# Altium schematic sheet SCH.SchDoc
size A; SheetNumber: 1; SheetTotal: 1
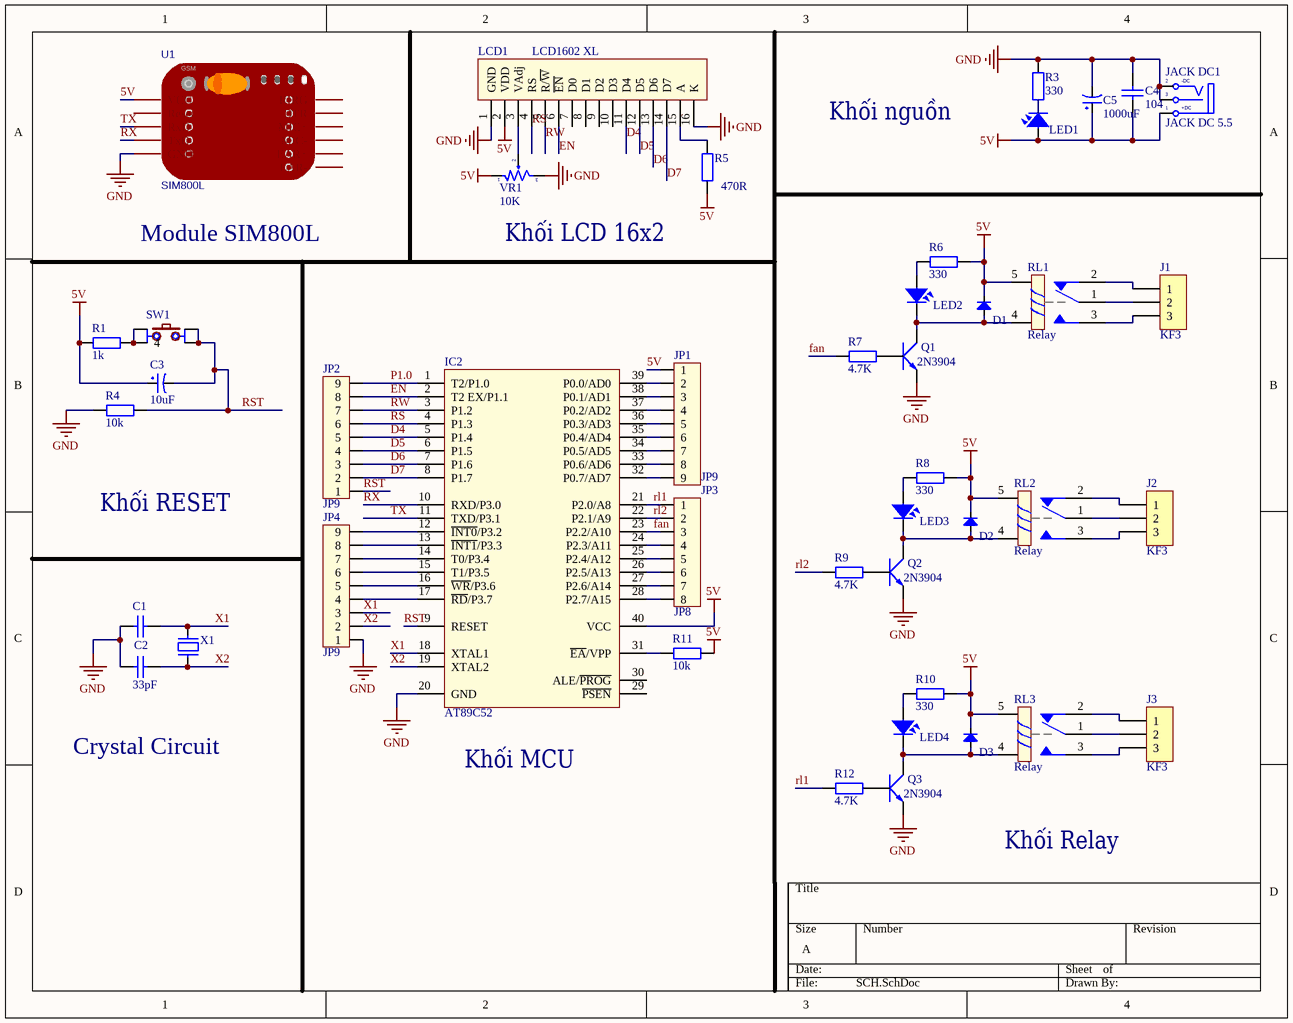
[diagram p0: SCH.SchDoc]

## Parts
C1  30pF  [tu gom]  (value not drawn)
C2  33pF  [tu gom]
C3  10uF  [tu hoa 4mm]
C4  104  [tu gom]
C5  1000uF  [tu hoa 10mm]
D1  Diode  [DIO-1A]  (value not drawn)
D2  Diode  [DIO-1A]  (value not drawn)
D3  Diode  [DIO-1A]  (value not drawn)
IC2  AT89C52  [DIP40/W0.6]
J1  KF3  [KF3-5.08]
J2  KF3  [KF3-5.08]
J3  KF3  [KF3-5.08]
JACK_DC1  JACK DC 5.5  [JACK DC 5.5]
JP1  JP9  [Header9]
JP2  JP9  [Header9]
JP3  JP8  [Header8]
JP4  JP9  [Header9]
LCD1  LCD1602 XL  [LCD1602 with Jump]
LED1  LED  [LED-5MM-RED]  (value not drawn)
LED2  LED  [LED-5MM-RED]  (value not drawn)
LED3  LED  [LED-5MM-RED]  (value not drawn)
LED4  LED  [LED-5MM-RED]  (value not drawn)
Q1  2N3904  [TO92-123]
Q2  2N3904  [TO92-123]
Q3  2N3904  [TO92-123]
R1  1k  [tro vach 1/4w]
R3  330  [tro vach 1/4w]
R4  10k  [tro vach 1/4w]
R5  470R  [tro vach 1/4w]
R6  330  [tro vach 1/4w]
R7  4.7K  [tro vach 1/4w]
R8  330  [tro vach 1/4w]
R9  4.7K  [tro vach 1/4w]
R10  330  [tro vach 1/4w]
R11  10k  [tro vach 1/4w]
R12  4.7K  [tro vach 1/4w]
RL1  Relay  [Relay 5 Chan SRD]
RL2  Relay  [Relay 5 Chan SRD]
RL3  Relay  [Relay 5 Chan SRD]
SW1  SW  [SW2-DIP]  (value not drawn)
U1  SIM800L  [SIM800L MODULE]
VR1  10K  [Bien Tro Volume Don]
X1  11.0592Mhz  [XT2]  (value not drawn)

## Nets
5V: C3.1 C4.2 C5.1 D1.2(K) D2.2(K) D3.2(K) IC2.40(VCC) JACK_DC1.1(T) JP1.1 LCD1.2(VDD) LED1.1 R1.1 R5.1 R6.2 R8.2 R10.2 R11.2 RL1.5 RL2.5 RL3.5 U1.1(VCC) VR1.1
GND: C1.2 C2.2 C4.1 C5.2 IC2.20(GND) JACK_DC1.2(TN) JACK_DC1.3(S) JP4.1 LCD1.1(GND) LCD1.16(K) Q1.1(E) Q2.1(E) Q3.1(E) R3.2 R4.1 U1.5(GND) VR1.3
D4: IC2.5(P1.4) JP2.5 LCD1.11(D4)
D5: IC2.6(P1.5) JP2.4 LCD1.12(D5)
D6: IC2.7(P1.6) JP2.3 LCD1.13(D6)
D7: IC2.8(P1.7) JP2.2 LCD1.14(D7)
EN: IC2.2(T2_EX/P1.1) JP2.8 LCD1.6(~{EN})
fan: IC2.23(P2.2/A10) JP3.3 R7.1
P1.0: IC2.1(T2/P1.0) JP2.9
rl1: IC2.21(P2.0/A8) JP3.1 R12.1
rl2: IC2.22(P2.1/A9) JP3.2 R9.1
RS: IC2.4(P1.3) JP2.6 LCD1.4(RS)
RST: C3.2 IC2.9(RESET) JP2.1 R4.2 SW1.2 SW1.3
RW: IC2.3(P1.2) JP2.7 LCD1.5(R/~{W})
RX: IC2.10(RXD/P3.0) U1.4(TxD)
TX: IC2.11(TXD/P3.1) U1.3(RxD)
X1: C1.1 IC2.18(XTAL1) JP4.3 X1.2
X2: C2.1 IC2.19(XTAL2) JP4.2 X1.1
NetD1_1: D1.1(A) LED2.2 Q1.3(C) RL1.4
NetD2_1: D2.1(A) LED3.2 Q2.3(C) RL2.4
NetD3_1: D3.1(A) LED4.2 Q3.3(C) RL3.4
NetIC2_12: IC2.12(~{INT0}/P3.2) JP4.9
NetIC2_13: IC2.13(~{INT1}/P3.3) JP4.8
NetIC2_14: IC2.14(T0/P3.4) JP4.7
NetIC2_15: IC2.15(T1/P3.5) JP4.6
NetIC2_16: IC2.16(~{WR}/P3.6) JP4.5
NetIC2_17: IC2.17(~{RD}/P3.7) JP4.4
NetIC2_24: IC2.24(P2.3/A11) JP3.4
NetIC2_25: IC2.25(P2.4/A12) JP3.5
NetIC2_26: IC2.26(P2.5/A13) JP3.6
NetIC2_27: IC2.27(P2.6/A14) JP3.7
NetIC2_28: IC2.28(P2.7/A15) JP3.8
NetIC2_31: IC2.31(~{EA}/VPP) R11.1
NetIC2_32: IC2.32(P0.7/AD7) JP1.9
NetIC2_33: IC2.33(P0.6/AD6) JP1.8
NetIC2_34: IC2.34(P0.5/AD5) JP1.7
NetIC2_35: IC2.35(P0.4/AD4) JP1.6
NetIC2_36: IC2.36(P0.3/AD3) JP1.5
NetIC2_37: IC2.37(P0.2/AD2) JP1.4
NetIC2_38: IC2.38(P0.1/AD1) JP1.3
NetIC2_39: IC2.39(P0.0/AD0) JP1.2
NetJ1_1: J1.1 RL1.2
NetJ1_2: J1.2 RL1.1
NetJ1_3: J1.3 RL1.3
NetJ2_1: J2.1 RL2.2
NetJ2_2: J2.2 RL2.1
NetJ2_3: J2.3 RL2.3
NetJ3_1: J3.1 RL3.2
NetJ3_2: J3.2 RL3.1
NetJ3_3: J3.3 RL3.3
NetLCD1_3: LCD1.3(VAdj) VR1.2
NetLCD1_15: LCD1.15(A) R5.2
NetLED1_2: LED1.2 R3.1
NetLED2_1: LED2.1 R6.1
NetLED3_1: LED3.1 R8.1
NetLED4_1: LED4.1 R10.1
NetQ1_2: Q1.2(B) R7.2
NetQ2_2: Q2.2(B) R9.2
NetQ3_2: Q3.2(B) R12.2
NetR1_2: R1.2 SW1.1 SW1.4

Not connected (* = marked no-connect by the designer): IC2 29(~{PSEN}) 30(ALE/~{PROG}); LCD1 7(D0) 8(D1) 9(D2) 10(D3); U1 2(Reset) 6(RIRG) 7(DTR) 8(MIC+) 9(MIC-) 10(EAR+) 11(EAR-)

## Notes on the sheet
- Khối nguồn
- Module SIM800L
- Khối LCD 16x2
- Khối RESET
- Crystal Circuit
- Khối MCU
- Khối Relay
- (in symbol JACK DC 5.5) -DC; +DC
- (in symbol SIM800L) GSM

## Library data of the parts
C1 C2 = Tu gom 30pF 50V: Cắm; Don_Vi: Con; So_Chan: 2; Ten_Linh_Kien: Tụ gốm 30P; Ma_Hang: MH004772; Chung_Loai: Cắm; Kieu_Chan: *
C3 = Tu Hoa 10uF 16V 4x7: Cắm; So_Chan: 2; Don_Vi: Con; Ten_Linh_Kien: Tụ Hóa 10uF 16V; Ma_Hang: MH006855; Chung_Loai: Cắm; Kieu_Chan: *
C4 = Tu gom 104 50V: Cắm; So_Chan: 2; Ten_Linh_Kien: Tụ gốm 104 100nF 50V; Don_Vi: Con; Ma_Hang: MH004761; Chung_Loai: Cắm; Kieu_Chan: *
C5 = Tu Hoa 1000uF 10V 10x12: Cắm; So_Chan: 2; Don_Vi: Con; Ten_Linh_Kien: Tụ Hóa 1000uF 10V 10x12MM; Ma_Hang: MH006614; Kieu_Chan: *; Chung_Loai: Cắm
D1-D3 = Diode: Default Diode; Code - JEDEC: DO-214-AB; Value: 1N5007; Published: 8-Jun-2000; Revision: July-2002: Re-released for DXP Platform.; Publisher: Altium Limited
IC2 = AT89C52: Cắm; Ten_Linh_Kien: AT89C52-24PC DIP40; Don_Vi: Con; Ma_Hang: MH002200; Ghi_Chu: *; Kieu _Chan: *; Chung_Loai: Cắm
J1-J3 = KF3: Manufacturer: Würth Elektronik eiSos GmbH; partNo: 691103110003; ComponentLink1 Description: Manufacturer; ComponentLink2 Description: Datasheet; NoPins: 3; Created Date: 29 October 2013; ComponentLink1URL: http://www.we-online.com; ComponentLink2URL: http://katalog.we-online.de/em/datasheet/6911031100xx.pdf; Created by: Karrer Zheng
JACK_DC1 = JACK DC 5.5: Value: Jac DC
JP1 JP2 JP4 = Header9: Connector 9; Value: Connector 9
JP3 = Header8: Connector 8; Value: Connector 8
LCD1 = LCD1602 XL: LCD 1602 Xanh Lá; Ten: Màn hình LCD 1602 Xanh Lá; Ma_Hang: 67HZ; NCC: NSHOP; CHIP: HD44780
LED1-LED4 = LED: LED Single colour Green and Red; Value: LED 3 ly Single Colour
Q1-Q3 = 2N904: NPN 600mW, ECB; Value: C1815
R1 R3-R12 = Tro Vach 1/4W 1% 10k: Cắm; Don_Vi: Con; So_Chan: 2; Ten_Linh_Kien: Trở Vạch 1/4w 1% 10k; Ma_Hang: MH006349; Chung_Loai: Cắm; Kieu_Chan: *
RL1-RL3 = Relay 5 Chan SRD: Relay 5 Chan; Ma_Hang: MH009374; Ten: Relay 5V10A SRD-05VDC-SL-C Chính Hãng
SW1 = SW4: Switch button 4 pin; Value: Button chip 4 pin
U1 = SIM800L: sourceId: ega4lDVPJ; Contributor: trigui; timeStamp: 1475502242; BOM_Supplier Part: B01DLIJM2E; BOM_Supplier: Amazon; spicePre: U
VR1 = Triet Ap Don 10k: Cắm; Don_Vi: Con; Ten_Linh_Kien: Triết Áp Đơn B10K; Ma_Hang: MH001417; Kieu_Chan: *; Chung_Loai: Cắm
X1 = XT2: Crystal, 32.768 KHz, -40 to 85 degC, 3.2 x 1.5 x 0.9 mm SMD; Value: 4Mhz